# Altium schematic sheet BMS-Sch.SchDoc
size 558 x 431 mm; SheetNumber: 1; SheetTotal: 1
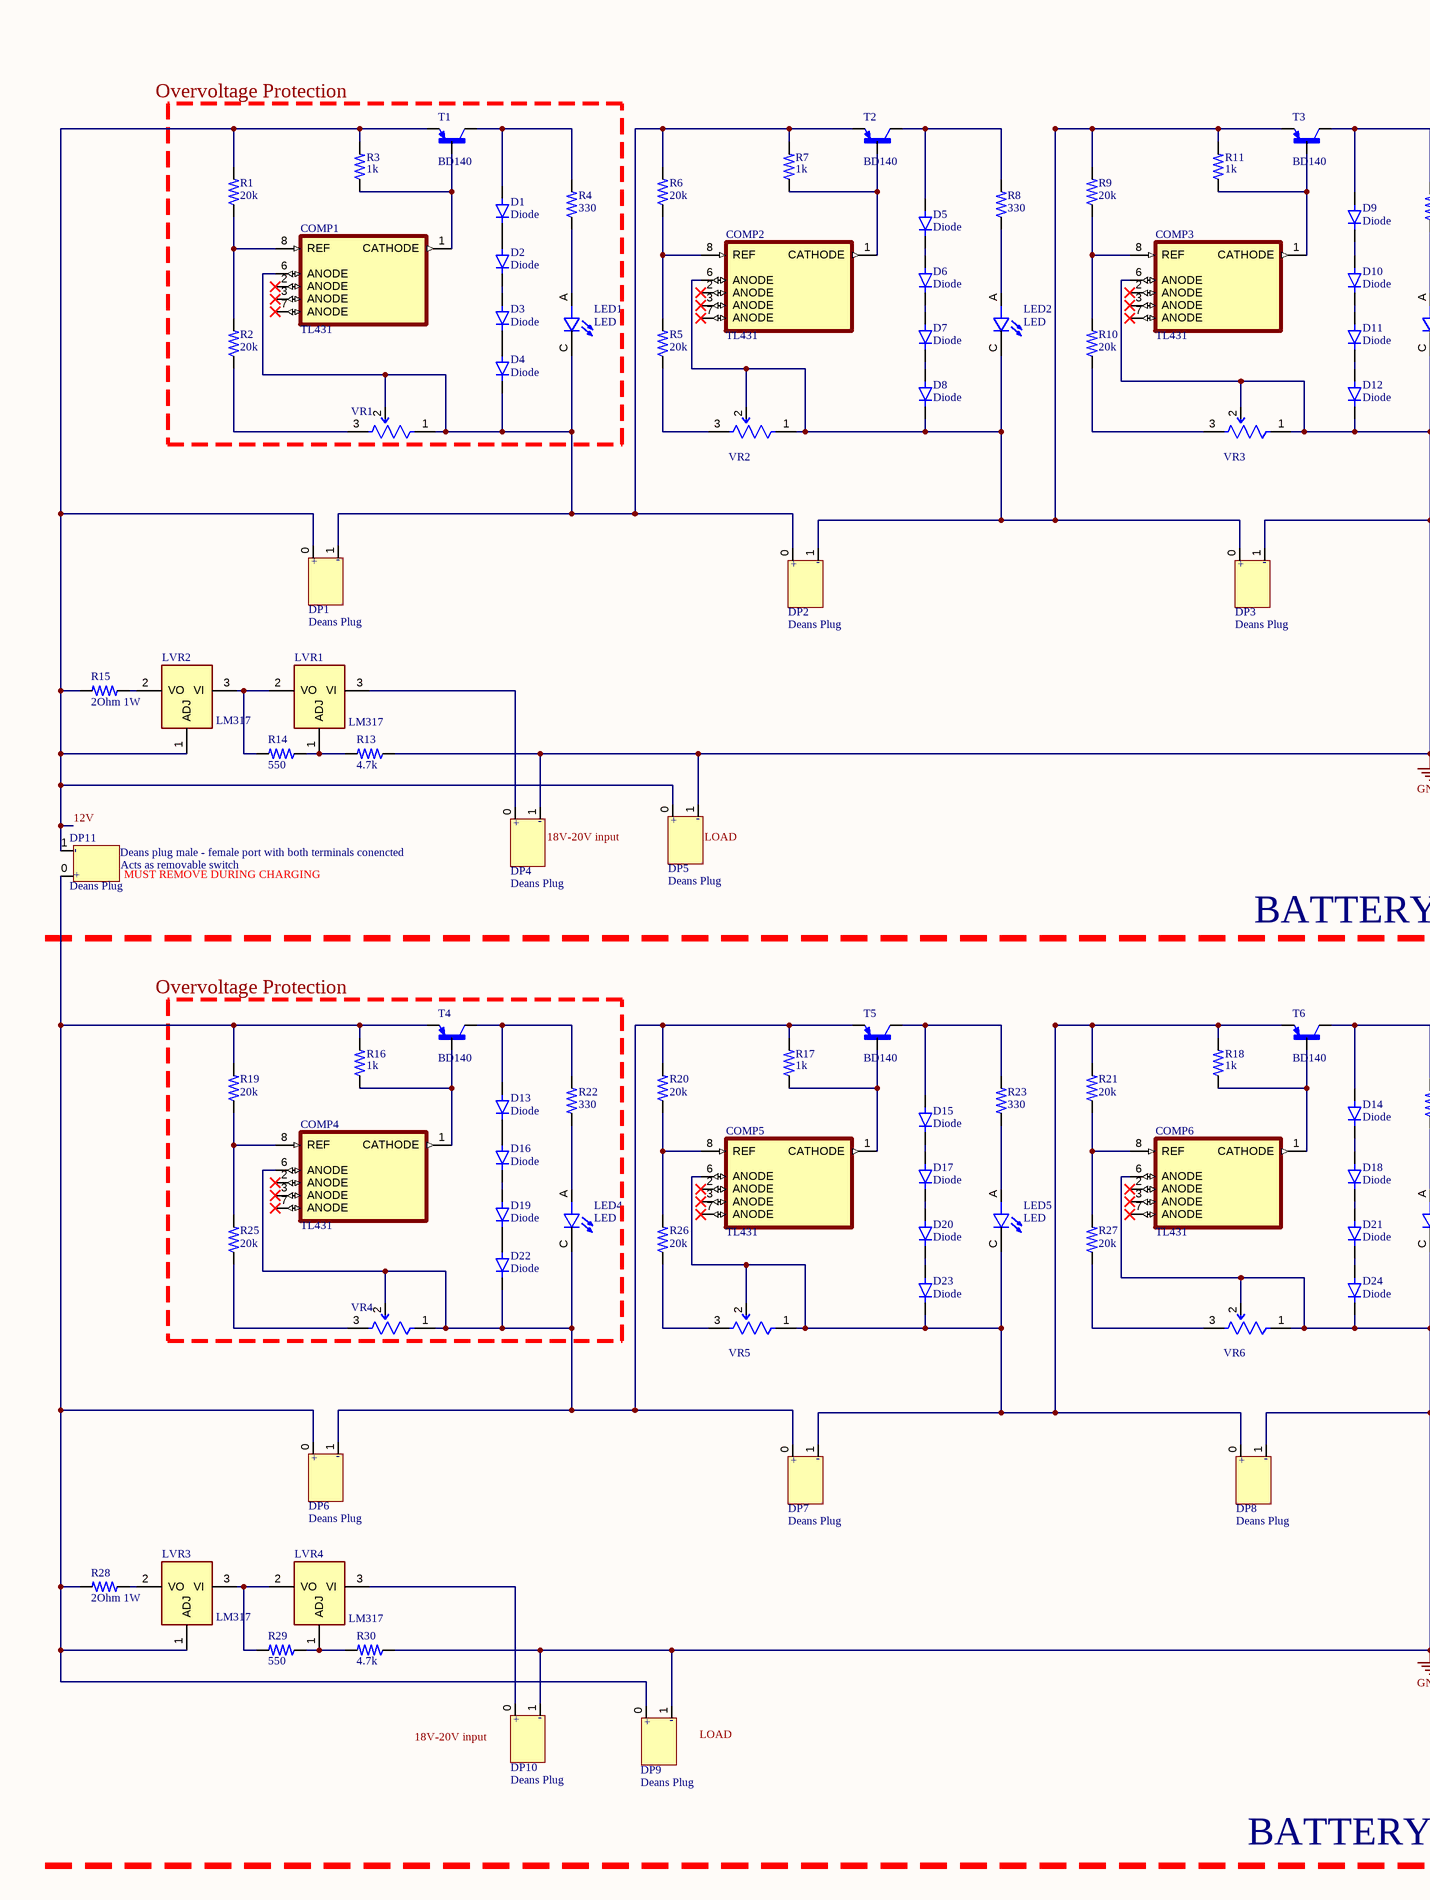
[diagram p0: BMS-Sch.SchDoc, left]
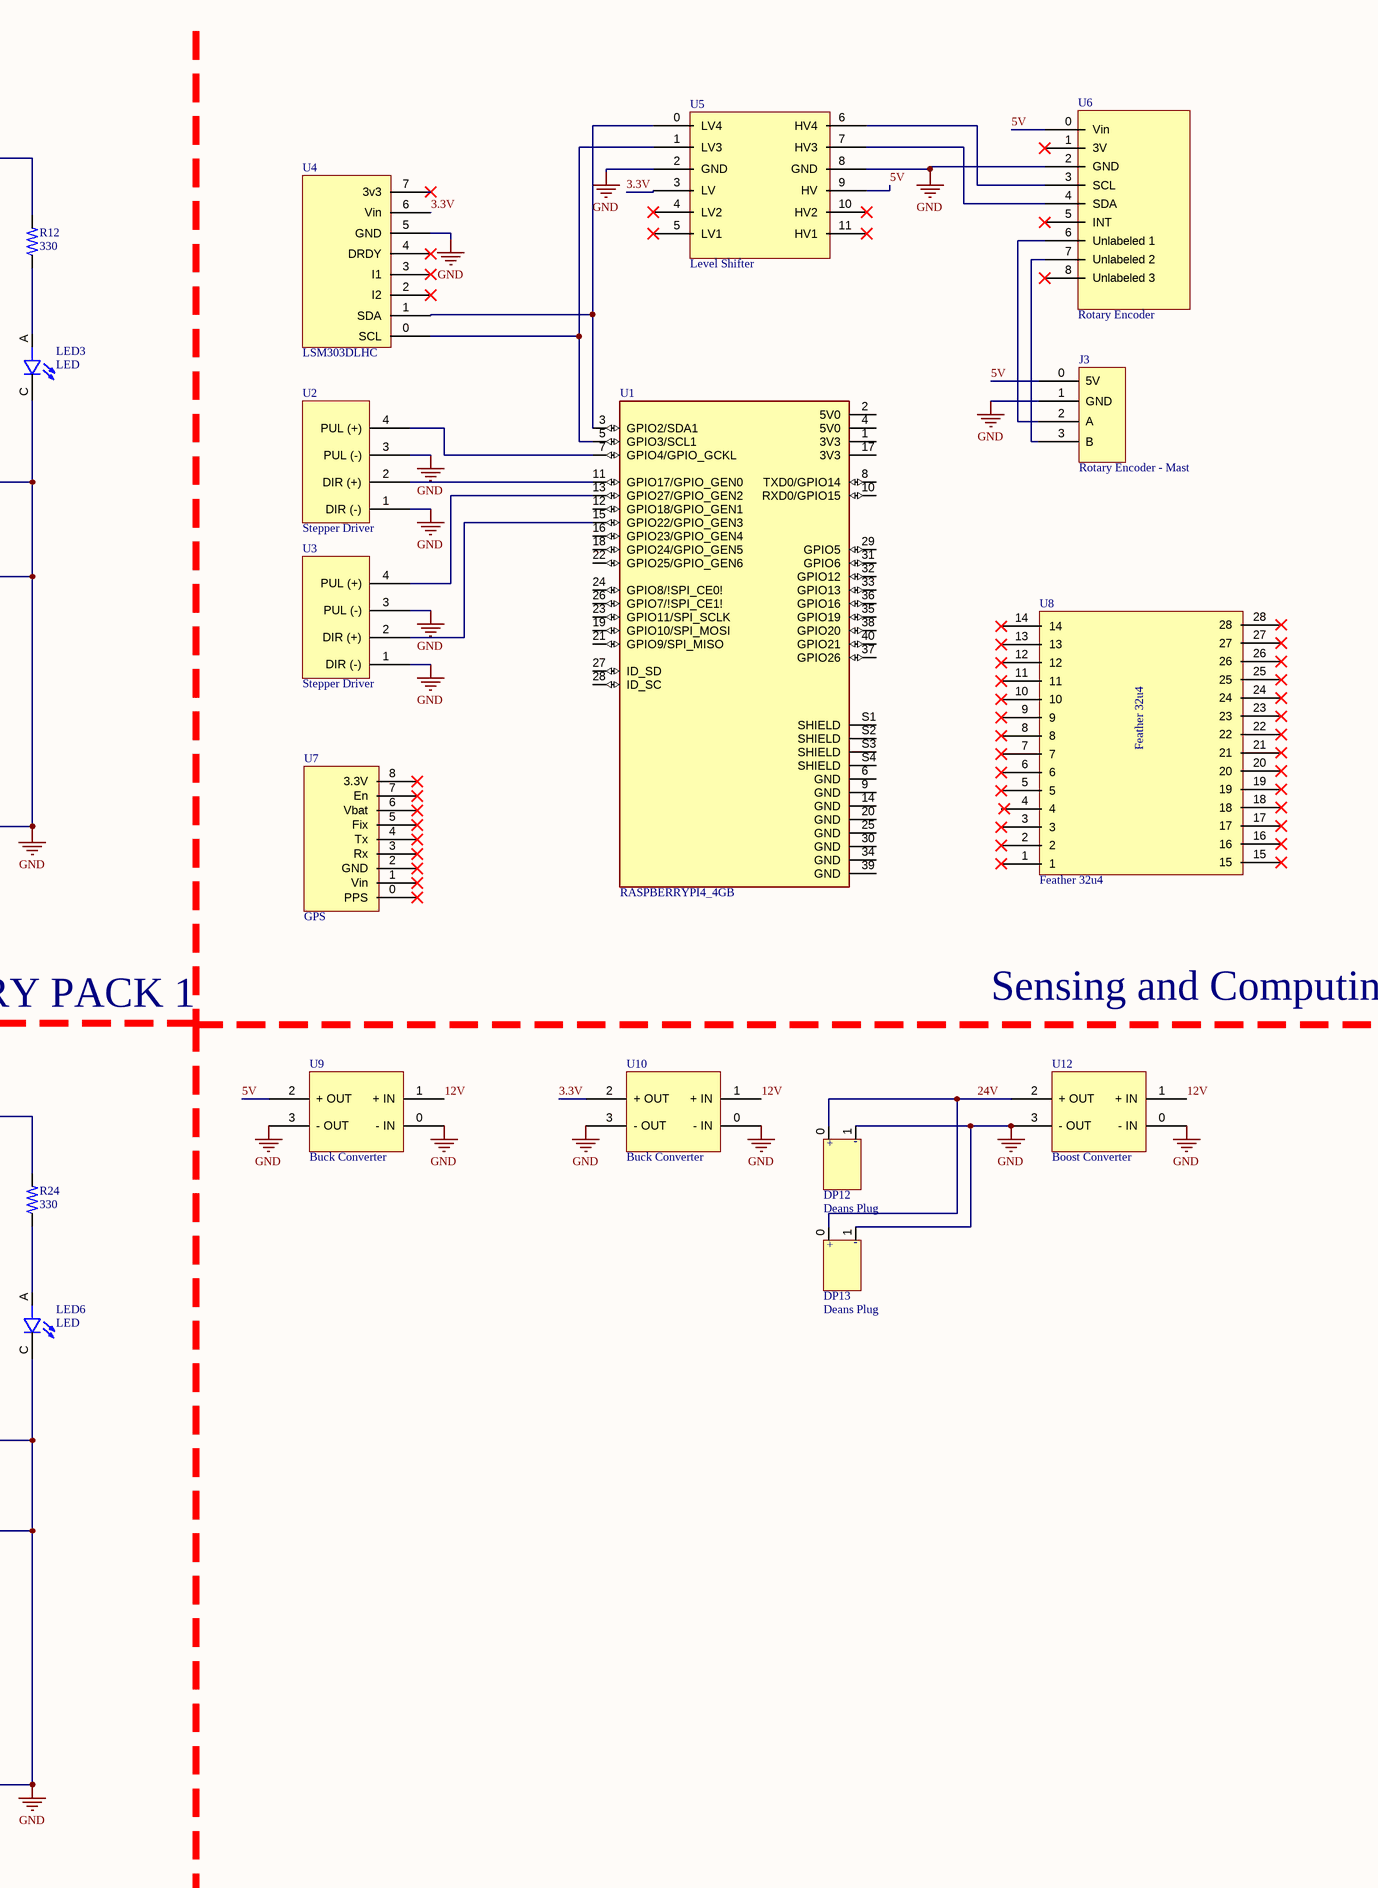
[diagram p1: BMS-Sch.SchDoc, right]

## Parts
COMP1  TL431  [SOIC127P599X175-8N]
COMP2  TL431  [SOIC127P599X175-8N]
COMP3  TL431  [SOIC127P599X175-8N]
COMP4  TL431  [SOIC127P599X175-8N]
COMP5  TL431  [SOIC127P599X175-8N]
COMP6  TL431  [SOIC127P599X175-8N]
D1  Diode  [DIOAD1060W80L520D270]
D2  Diode  [DIOAD1060W80L520D270]
D3  Diode  [DIOAD1060W80L520D270]
D4  Diode  [DIOAD1060W80L520D270]
D5  Diode  [DIOAD1060W80L520D270]
D6  Diode  [DIOAD1060W80L520D270]
D7  Diode  [DIOAD1060W80L520D270]
D8  Diode  [DIOAD1060W80L520D270]
D9  Diode  [DIOAD1060W80L520D270]
D10  Diode  [DIOAD1060W80L520D270]
D11  Diode  [DIOAD1060W80L520D270]
D12  Diode  [DIOAD1060W80L520D270]
D13  Diode  [DIOAD1060W80L520D270]
D14  Diode  [DIOAD1060W80L520D270]
D15  Diode  [DIOAD1060W80L520D270]
D16  Diode  [DIOAD1060W80L520D270]
D17  Diode  [DIOAD1060W80L520D270]
D18  Diode  [DIOAD1060W80L520D270]
D19  Diode  [DIOAD1060W80L520D270]
D20  Diode  [DIOAD1060W80L520D270]
D21  Diode  [DIOAD1060W80L520D270]
D22  Diode  [DIOAD1060W80L520D270]
D23  Diode  [DIOAD1060W80L520D270]
D24  Diode  [DIOAD1060W80L520D270]
DP1  Deans Plug  [Deans Connector]
DP2  Deans Plug  [Deans Connector]
DP3  Deans Plug  [Deans Connector]
DP4  Deans Plug  [Deans Connector]
DP5  Deans Plug  [Deans Connector]
DP6  Deans Plug  [Deans Connector]
DP7  Deans Plug  [Deans Connector]
DP8  Deans Plug  [Deans Connector]
DP9  Deans Plug  [Deans Connector]
DP10  Deans Plug  [Deans Connector]
DP11  Deans Plug  [Deans Connector]
DP12  Deans Plug  [Deans Connector]
DP13  Deans Plug  [Deans Connector]
J3  Rotary Encoder - Mast  [Rotary Encoder - Mast]
LED1  LED  [LED_151054RS03000]
LED2  LED  [LED_151054RS03000]
LED3  LED  [LED_151054RS03000]
LED4  LED  [LED_151054RS03000]
LED5  LED  [LED_151054RS03000]
LED6  LED  [LED_151054RS03000]
LVR1  LM317  [TO245P780X300X1364-3]
LVR2  LM317  [TO245P780X300X1364-3]
LVR3  LM317  [TO245P780X300X1364-3]
LVR4  LM317  [TO245P780X300X1364-3]
R1  20k  [RESC2012X65N]
R2  20k  [RESC2012X65N]
R3  1k  [RESC2012X65N]
R4  330  [RESC2012X65N]
R5  20k  [RESC2012X65N]
R6  20k  [RESC2012X65N]
R7  1k  [RESC2012X65N]
R8  330  [RESC2012X65N]
R9  20k  [RESC2012X65N]
R10  20k  [RESC2012X65N]
R11  1k  [RESC2012X65N]
R12  330  [RESC2012X65N]
R13  4.7k  [RESC2012X65N]
R14  550  [RESC2012X65N]
R15  2Ohm 1W  [RESC2012X65N]
R16  1k  [RESC2012X65N]
R17  1k  [RESC2012X65N]
R18  1k  [RESC2012X65N]
R19  20k  [RESC2012X65N]
R20  20k  [RESC2012X65N]
R21  20k  [RESC2012X65N]
R22  330  [RESC2012X65N]
R23  330  [RESC2012X65N]
R24  330  [RESC2012X65N]
R25  20k  [RESC2012X65N]
R26  20k  [RESC2012X65N]
R27  20k  [RESC2012X65N]
R28  2Ohm 1W  [RESC2012X65N]
R29  550  [RESC2012X65N]
R30  4.7k  [RESC2012X65N]
T1  BD140  [TO245P780X300X1364-3]
T2  BD140  [TO245P780X300X1364-3]
T3  BD140  [TO245P780X300X1364-3]
T4  BD140  [TO245P780X300X1364-3]
T5  BD140  [TO245P780X300X1364-3]
T6  BD140  [TO245P780X300X1364-3]
U1  RASPBERRYPI4_4GB  [RPi Pad]
U2  Stepper Driver  [STEPPER DRIVER Pad]
U3  Stepper Driver  [STEPPER DRIVER Pad]
U4  LSM303DLHC  [COMPASS PAD]
U5  Level Shifter  [LEVEL SHIFTER PAD]
U6  Rotary Encoder  [ROTARY ENCODER - Hull]
U7  GPS  [GPS Pad]
U8  Feather 32u4  [LoRa PAD]
U9  Buck Converter  [BUCK Pad]
U10  Buck Converter  [BUCK Pad]
U12  Boost Converter  [Boost Pad]
VR1  Res_Bourns_3296W-1-502LF_eec  [Bourns_3296W-1-502LF_0]  (value not drawn)
VR2  Res_Bourns_3296W-1-502LF_eec  [Bourns_3296W-1-502LF_0]  (value not drawn)
VR3  Res_Bourns_3296W-1-502LF_eec  [Bourns_3296W-1-502LF_0]  (value not drawn)
VR4  Res_Bourns_3296W-1-502LF_eec  [Bourns_3296W-1-502LF_0]  (value not drawn)
VR5  Res_Bourns_3296W-1-502LF_eec  [Bourns_3296W-1-502LF_0]  (value not drawn)
VR6  Res_Bourns_3296W-1-502LF_eec  [Bourns_3296W-1-502LF_0]  (value not drawn)

## Nets
GND: COMP3.6(ANODE) COMP6.6(ANODE) D12.C D24.C DP3.1 DP4.1 DP5.1 DP8.1 DP9.1 DP10.1 DP12.1 DP13.1 J3.1(GND) LED3.C LED6.C R13.1 R30.1 U2.1(DIR_(-)) U2.3(PUL_(-)) U3.1(DIR_(-)) U3.3(PUL_(-)) U4.5(GND) U5.2(GND) U5.8(GND) U6.2(GND) U9.0(-_IN) U9.3(-_OUT) U10.0(-_IN) U10.3(-_OUT) U12.0(-_IN) U12.3(-_OUT) VR3.1(CCW) VR3.2(WIPER) VR6.1(CCW) VR6.2(WIPER)
3.3V: U4.6(Vin) U5.3(LV) U10.2(+_OUT)
5V: J3.0(5V) U5.9(HV) U6.0(Vin) U9.2(+_OUT)
12V: DP1.0 DP5.0 DP11.1 LVR2.1(ADJ) R1.2 R3.2 R15.2 T1.1(E) U9.1(+_IN) U10.1(+_IN) U12.1(+_IN)
24V: DP12.0 DP13.0 U12.2(+_OUT)
NetCOMP1_1: COMP1.1(CATHODE) R3.1 T1.3(B)
NetCOMP1_6: COMP1.6(ANODE) D4.C DP1.1 DP2.0 LED1.C R6.2 R7.2 T2.1(E) VR1.1(CCW) VR1.2(WIPER)
NetCOMP1_8: COMP1.8(REF) R1.1 R2.2
NetCOMP2_1: COMP2.1(CATHODE) R7.1 T2.3(B)
NetCOMP2_6: COMP2.6(ANODE) D8.C DP2.1 DP3.0 LED2.C R9.2 R11.2 T3.1(E) VR2.1(CCW) VR2.2(WIPER)
NetCOMP2_8: COMP2.8(REF) R5.2 R6.1
NetCOMP3_1: COMP3.1(CATHODE) R11.1 T3.3(B)
NetCOMP3_8: COMP3.8(REF) R9.1 R10.2
NetCOMP4_1: COMP4.1(CATHODE) R16.1 T4.3(B)
NetCOMP4_6: COMP4.6(ANODE) D22.C DP6.1 DP7.0 LED4.C R17.2 R20.2 T5.1(E) VR4.1(CCW) VR4.2(WIPER)
NetCOMP4_8: COMP4.8(REF) R19.1 R25.2
NetCOMP5_1: COMP5.1(CATHODE) R17.1 T5.3(B)
NetCOMP5_6: COMP5.6(ANODE) D23.C DP7.1 DP8.0 LED5.C R18.2 R21.2 T6.1(E) VR5.1(CCW) VR5.2(WIPER)
NetCOMP5_8: COMP5.8(REF) R20.1 R26.2
NetCOMP6_1: COMP6.1(CATHODE) R18.1 T6.3(B)
NetCOMP6_8: COMP6.8(REF) R21.1 R27.2
NetD1_A: D1.A R4.2 T1.2(C)
NetD1_C: D1.C D2.A
NetD2_C: D2.C D3.A
NetD3_C: D3.C D4.A
NetD5_A: D5.A R8.2 T2.2(C)
NetD5_C: D5.C D6.A
NetD6_C: D6.C D7.A
NetD7_C: D7.C D8.A
NetD9_A: D9.A R12.2 T3.2(C)
NetD9_C: D9.C D10.A
NetD10_C: D10.C D11.A
NetD11_C: D11.C D12.A
NetD13_A: D13.A R22.2 T4.2(C)
NetD13_C: D13.C D16.A
NetD14_A: D14.A R24.2 T6.2(C)
NetD14_C: D14.C D18.A
NetD15_A: D15.A R23.2 T5.2(C)
NetD15_C: D15.C D17.A
NetD16_C: D16.C D19.A
NetD17_C: D17.C D20.A
NetD18_C: D18.C D21.A
NetD19_C: D19.C D22.A
NetD20_C: D20.C D23.A
NetD21_C: D21.C D24.A
NetDP4_0: DP4.0 LVR1.3(VI)
NetDP6_0: DP6.0 DP9.0 DP11.0 LVR3.1(ADJ) R16.2 R19.2 R28.2 T4.1(E)
NetDP10_0: DP10.0 LVR4.3(VI)
NetJ3_2: J3.2(A) U6.6(Unlabeled_1)
NetJ3_3: J3.3(B) U6.7(Unlabeled_2)
NetLED1_A: LED1.A R4.1
NetLED2_A: LED2.A R8.1
NetLED3_A: LED3.A R12.1
NetLED4_A: LED4.A R22.1
NetLED5_A: LED5.A R23.1
NetLED6_A: LED6.A R24.1
NetLVR1_1: LVR1.1(ADJ) R13.2 R14.1
NetLVR1_2: LVR1.2(VO) LVR2.3(VI) R14.2
NetLVR2_2: LVR2.2(VO) R15.1
NetLVR3_2: LVR3.2(VO) R28.1
NetLVR3_3: LVR3.3(VI) LVR4.2(VO) R29.2
NetLVR4_1: LVR4.1(ADJ) R29.1 R30.2
NetR2_1: R2.1 VR1.3(CW)
NetR5_1: R5.1 VR2.3(CW)
NetR10_1: R10.1 VR3.3(CW)
NetR25_1: R25.1 VR4.3(CW)
NetR26_1: R26.1 VR5.3(CW)
NetR27_1: R27.1 VR6.3(CW)
NetU1_3: U1.3(GPIO2/SDA1) U4.1(SDA) U5.0(LV4)
NetU1_5: U1.5(GPIO3/SCL1) U4.0(SCL) U5.1(LV3)
NetU1_7: U1.7(GPIO4/GPIO_GCKL) U2.4(PUL_(+))
NetU1_11: U1.11(GPIO17/GPIO_GEN0) U2.2(DIR_(+))
NetU1_13: U1.13(GPIO27/GPIO_GEN2) U3.4(PUL_(+))
NetU1_15: U1.15(GPIO22/GPIO_GEN3) U3.2(DIR_(+))
NetU5_6: U5.6(HV4) U6.3(SCL)
NetU5_7: U5.7(HV3) U6.4(SDA)

Not connected (* = marked no-connect by the designer): COMP1 2(ANODE)* 3(ANODE)* 7(ANODE)*; COMP2 2(ANODE)* 3(ANODE)* 7(ANODE)*; COMP3 2(ANODE)* 3(ANODE)* 7(ANODE)*; COMP4 2(ANODE)* 3(ANODE)* 7(ANODE)*; COMP5 2(ANODE)* 3(ANODE)* 7(ANODE)*; COMP6 2(ANODE)* 3(ANODE)* 7(ANODE)*; U1 1(3V3) 2(5V0) 4(5V0) 6(GND) 8(TXD0/GPIO14) 9(GND) 10(RXD0/GPIO15) 12(GPIO18/GPIO_GEN1) 14(GND) 16(GPIO23/GPIO_GEN4) 17(3V3) 18(GPIO24/GPIO_GEN5) 19(GPIO10/SPI_MOSI) 20(GND) 21(GPIO9/SPI_MISO) 22(GPIO25/GPIO_GEN6) 23(GPIO11/SPI_SCLK) 24(GPIO8/!SPI_CE0!) 25(GND) 26(GPIO7/!SPI_CE1!) 27(ID_SD) 28(ID_SC) 29(GPIO5) 30(GND) 31(GPIO6) 32(GPIO12) 33(GPIO13) 34(GND) 35(GPIO19) 36(GPIO16) 37(GPIO26) 38(GPIO20) 39(GND) 40(GPIO21) S1(SHIELD) S2(SHIELD) S3(SHIELD) S4(SHIELD); U4 2(I2)* 3(I1)* 4(DRDY)* 7(3v3)*; U5 4(LV2)* 5(LV1)* 10(HV2)* 11(HV1)*; U6 1(3V)* 5(INT)* 8(Unlabeled_3)*; U7 0(PPS)* 1(Vin)* 2(GND)* 3(Rx)* 4(Tx)* 5(Fix)* 6(Vbat)* 7(En)* 8(3.3V)*; U8 1* 2* 3* 4 5* 6* 7* 8* 9* 10* 11* 12* 13* 14* 15* 16* 17* 18* 19* 20* 21* 22* 23* 24* 25* 26* 27* 28*

## Notes on the sheet
- Overvoltage Protection
- (near DP11) Acts as removable switch
- (near DP11) Deans plug male - female port with both terminals conencted
- (near DP4) 18V-20V input
- (near DP5) LOAD
- MUST REMOVE DURING CHARGING
- BATTERY PACK 1
- Sensing and Computing
- (near DP10) 18V-20V input
- (near DP9) LOAD
- BATTERY PACK 2
- DWG. NO.
- REV.
- SHT.
- REVISION
- DESCRIPTION
- DATE
- APPROVED
- THIS DOCUMENT AND THE DATA DISCLOSED HEREIN OR HEREWITH IS THE PROPERTY OF ALTIUM LIMITED AND MAY BE FREELY DISTRIBUTED IN WHOLE. NO RIGHTS ARE RESERVED OR EXPRESS OR IMPLIED WARANTEE GIVEN.
- ENG:
- DSN:
- APPROVALS
- PROJECT
- DOCUMENT REVISION:
- DESIGN ITEM:
- CHK:
- BOM:
- REFERENCE DOCUMENTS
- PROJECT REVISION:
- TITLE
- FAB DWG:
- PCB DWG:
- ASSY DWG:
- SCALE:
- SIZE
- C
- CAGE CODE
- FILE NAME
- DWG NO.
- SHEET
- OF
- REV
- (in symbol Deans Plug) +; -

## Library data of the parts
COMP1-COMP6 = TL431: Adjustable precision shunt regulator 8-SOIC 0 to 70; MF: Texas Instruments; MP: TL431CD; Price: None; Value: *; Availability: Good; DigiKey-Purchase-URL: https://snapeda.com/shop?store=DigiKey&id=4775895; Mouser-Purchase-URL: https://snapeda.com/shop?store=Mouser&id=4775895; SnapEDA_Link: https://www.snapeda.com/parts/TL431CD/Texas%20Instruments/view-part/4775895/?ref=snap; Texas_Instruments-Purchase-URL: https://snapeda.com/shop?store=Texas+Instruments&id=4775895; Package: SOIC-8 Texas Instruments
D1-D24 = Diode: Diode Standard 1000V 1A Through Hole DO-204AL _DO-41_; MF: ON Semiconductor; MP: 1N4007; Package: DO-41 Good-Ark; Value: *; Price: None; Availability: Unavailable; SnapEDA_Link: https://www.snapeda.com/parts/1N4007/ON%20Semiconductor/view-part/2816213/?ref=snap
LED1-LED6 = LED: Red 623nm LED Indication - Discrete 1.9V Radial; MF: Wurth Electronics; MP: 151054RS03000; Value: *; SnapEDA_Link: https://www.snapeda.com/parts/151054RS03000/Wurth%20Electronics%20Inc./view-part/609365/?ref=snap; Price: None; Availability: Unavailable; Package: Radial WÃ¼rth Elektronik
LVR1-LVR4 = LM317: Linear Voltage Regulator IC 1 Output 100mA SOT-89-3; MF: ON Semiconductor; Value: *; Price: None; Availability: Unavailable; SnapEDA_Link: https://www.snapeda.com/parts/LM317/ON%20Semiconductor/view-part/2723883/?ref=snap; Package: SOIC-8 ON Semiconductor; MP: LM317
R1 R2 R5 R6 R9 R10 R19-R21 R25-R27 = Resistor: RES 20k OHM 1% 1/4W 0805; Resistance: .33; MF: TE Connectivity; Power_Rating: .25 W; MP: 2-2176053-0; Price: None; EU_RoHS_Compliance: Compliant with Exemptions; Tolerance: 1%; Value: *; Availability: Unavailable; SnapEDA_Link: https://www.snapeda.com/parts/2-2176053-0/TE%20Connectivity/view-part/2214508/?ref=snap; Package: 0805
R3 R7 R11 R16-R18 = Resistor: RES 1k OHM 1% 1/4W 0805; Resistance: .33; MF: TE Connectivity; Power_Rating: .25 W; MP: 2-2176053-0; Price: None; EU_RoHS_Compliance: Compliant with Exemptions; Tolerance: 1%; Value: *; Availability: Unavailable; SnapEDA_Link: https://www.snapeda.com/parts/2-2176053-0/TE%20Connectivity/view-part/2214508/?ref=snap; Package: 0805
R4 R8 R12 R22-R24 = Resistor: RES 330 OHM 1% 1/4W 0805; Resistance: .33; MF: TE Connectivity; Power_Rating: .25 W; MP: 2-2176053-0; Price: None; EU_RoHS_Compliance: Compliant with Exemptions; Tolerance: 1%; Value: *; Availability: Unavailable; SnapEDA_Link: https://www.snapeda.com/parts/2-2176053-0/TE%20Connectivity/view-part/2214508/?ref=snap; Package: 0805
R13 R30 = Resistor: RES 4.7k OHM 1% 1/4W 0805; Resistance: .33; MF: TE Connectivity; Power_Rating: .25 W; MP: 2-2176053-0; Price: None; EU_RoHS_Compliance: Compliant with Exemptions; Tolerance: 1%; Value: *; Availability: Unavailable; SnapEDA_Link: https://www.snapeda.com/parts/2-2176053-0/TE%20Connectivity/view-part/2214508/?ref=snap; Package: 0805
R14 R29 = Resistor: RES 550 OHM 1% 1/4W 0805; Resistance: .33; MF: TE Connectivity; Power_Rating: .25 W; MP: 2-2176053-0; Price: None; EU_RoHS_Compliance: Compliant with Exemptions; Tolerance: 1%; Value: *; Availability: Unavailable; SnapEDA_Link: https://www.snapeda.com/parts/2-2176053-0/TE%20Connectivity/view-part/2214508/?ref=snap; Package: 0805
R15 R28 = Resistor: RES 2 OHM 1% 1/4W 0805; Resistance: .33; MF: TE Connectivity; Power_Rating: .25 W; MP: 2-2176053-0; Price: None; EU_RoHS_Compliance: Compliant with Exemptions; Tolerance: 1%; Value: *; Availability: Unavailable; SnapEDA_Link: https://www.snapeda.com/parts/2-2176053-0/TE%20Connectivity/view-part/2214508/?ref=snap; Package: 0805
T1-T6 = BD140: Bipolar _BJT_ Transistor PNP 80V 1.5A 1.25W Through Hole SOT-32-3; MF: STMicroelectronics; SnapEDA_Link: https://www.snapeda.com/parts/BD140/STMicroelectronics/view-part/4503197/?ref=snap; Value: *; MP: BD140; Package: TO-126 STMicroelectronics; Price: None; Availability: Unavailable
U1 = RASPBERRYPI4_4GB: BCM2711 Raspberry Pi 4 Model B 4GB - ARMÂ® CortexÂ®-A72 MPU Embedded Evaluation Board; MF: Raspberry Pi Foundation (NF); MP: RASPBERRYPI4 4GB; Price: None; Availability: Unavailable; Package: None; SnapEDA_Link: https://www.snapeda.com/parts/RASPBERRYPI4%204GB/Raspberry%20Pi/view-part/3832294/?ref=snap; Value: *
VR1-VR6 = Res_Bourns_3296W-1-502LF_eec: RES TRIMMER 5K OHM 0.5W PC PIN; Manufacturer: Bourns; Resistance: 5kΩ; Value: 5kΩ; Temperature Coefficient: ±100ppm/°C; Tolerance: ±10%; Number of Turns: 25; Power: 500mW; Part Number: 3296W-1-502LF; helpURL: https://upverter.com/upn/revision/1712d714ad2c9eb5/; ComponentLink2Description: Datasheet; Temperature: -55°C to +125°C; Package: PTH_9MM53_4MM83; Supplier 2: Mouser; Price: 1.73531008228; Supplier 1: Digi-Key; ComponentLink1URL: https://upverter.com/upn/revision/1712d714ad2c9eb5/; Supplier Part Number 2: 652-3296W-1-502LF; Supplier Part Number 1: 3296W-502LF-ND; ComponentLink1Description: Upverter; ComponentLink2URL: http://www.bourns.com/docs/Product-Datasheets/3296.pdf; RoHS: TRUE; Mouser Part Number: 652-3296W-1-502LF; Temperature Range High: +125°C; Digikey Description: RES TRIMMER 5K OHM 0.5W PC PIN; Digikey Part Number: 3296W-502LF-ND; Lead Free: yes; Temperature Range Low: -55°C